# EAGLE design Easy_LED (EAGLE 6.4)
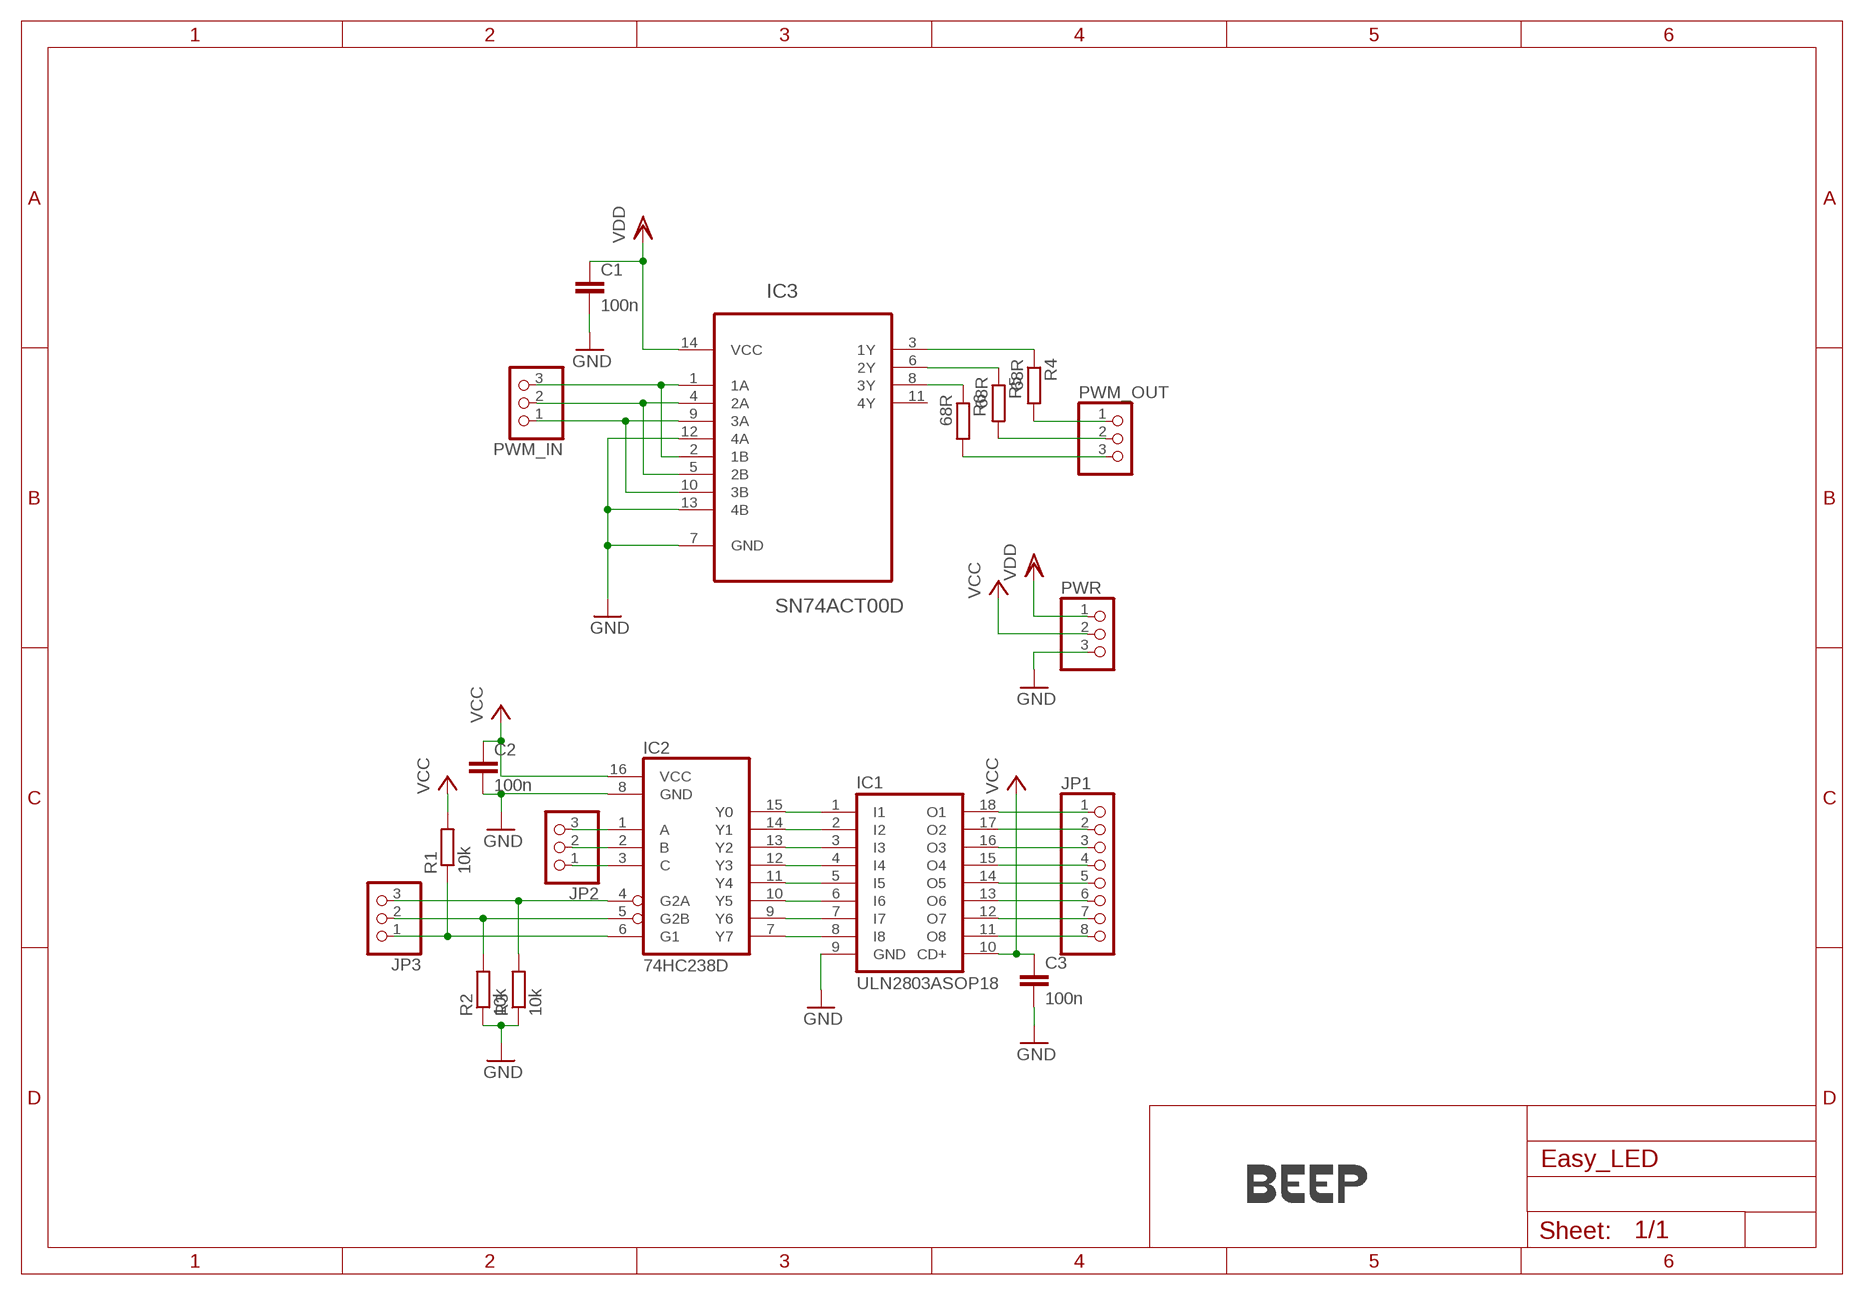
[diagram p0: schematic, sheet 1]

## Parts
C1  100n  C-EUC0805  [C0805]
C2  100n  C-EUC0805  [C0805]
C3  100n  C-EUC0805  [C0805]
IC1  ULN2803ASOP18  [SOP18]
IC2  74HC238D  [SO16]
IC3  SN74ACT00D  [SOIC127P600X175-14N]
JP1  PINHD-1X8  [1X08]
JP2  PINHD-1X3  [1X03]
JP3  PINHD-1X3  [1X03]
PWM_IN  PINHD-1X3  [1X03]
PWM_OUT  PINHD-1X3  [1X03]
PWR  PINHD-1X3  [1X03]
R1  10k  R-EU_0207/7  [0207/7]
R2  10k  R-EU_M0805  [M0805]
R3  10k  R-EU_M0805  [M0805]
R4  68R  R-EU_M0805  [M0805]
R5  68R  R-EU_M0805  [M0805]
R6  68R  R-EU_M0805  [M0805]
U$4  LOGO-COPPER6  [COPPER6]

## Nets
GND: C1.2 C2.2 C3.2 IC1.9(GND) IC2.8(GND) IC3.7(GND) IC3.12(4A) IC3.13(4B) PWR.3 R2.1 R3.1
N$1: IC1.17(O2) JP1.2
N$2: IC1.16(O3) JP1.3
N$3: IC1.15(O4) JP1.4
N$4: IC1.14(O5) JP1.5
N$5: IC1.13(O6) JP1.6
N$6: IC1.12(O7) JP1.7
N$7: IC1.18(O1) JP1.1
N$8: IC1.1(I1) IC2.15(Y0)
N$9: IC1.2(I2) IC2.14(Y1)
N$10: IC1.3(I3) IC2.13(Y2)
N$11: IC1.11(O8) JP1.8
N$12: IC3.1(1A) IC3.2(1B) PWM_IN.3
N$13: IC3.4(2A) IC3.5(2B) PWM_IN.2
N$14: IC3.9(3A) IC3.10(3B) PWM_IN.1
N$15: IC1.4(I4) IC2.12(Y3)
N$16: IC1.5(I5) IC2.11(Y4)
N$17: IC1.6(I6) IC2.10(Y5)
N$18: PWM_OUT.3 R6.2
N$19: PWM_OUT.2 R5.2
N$20: PWM_OUT.1 R4.2
N$21: IC3.3(1Y) R4.1
N$22: IC1.7(I7) IC2.9(Y6)
N$23: IC1.8(I8) IC2.7(Y7)
N$24: IC2.1(A) JP2.3
N$25: IC3.6(2Y) R5.1
N$26: IC3.8(3Y) R6.1
N$29: IC2.2(B) JP2.2
N$30: IC2.3(C) JP2.1
N$31: IC2.4(G2A) JP3.3 R3.2
N$36: IC2.5(G2B) JP3.2 R2.2
N$37: IC2.6(G1) JP3.1 R1.1
VCC: C2.1 C3.1 IC1.10(CD+) IC2.16(VCC) PWR.2 R1.2
VDD: C1.1 IC3.14(VCC) PWR.1
Unconnected: IC3.11(4Y)

## Library data of the parts
C1-C3 = rcl:C-EU: CAPACITOR, European symbol
IC1 = BEEP:ULN2803A: DRIVER ARRAY
IC2 = BEEP:74HC238: 3 to 8 line DECODER/DEMULTIPLEXER
IC3 = Texas Instruments_By_element14_Batch_1:SN74ACT00D: QUADRUPLE 2 INPUT POSITIVE NAND GATES; MPN: SN74ACT00D; OC_FARNELL: 9590315; OC_NEWARK: 52F2384; PACKAGE: SOIC-14; SUPPLIER: Texas Instruments
JP1 = pinhead:PINHD-1X8: PIN HEADER
JP2 JP3 PWM_IN PWM_OUT PWR = pinhead:PINHD-1X3: PIN HEADER
R1-R6 = rcl:R-EU_: RESISTOR, European symbol
U$4 = Branding:LOGO-COPPER

## Board
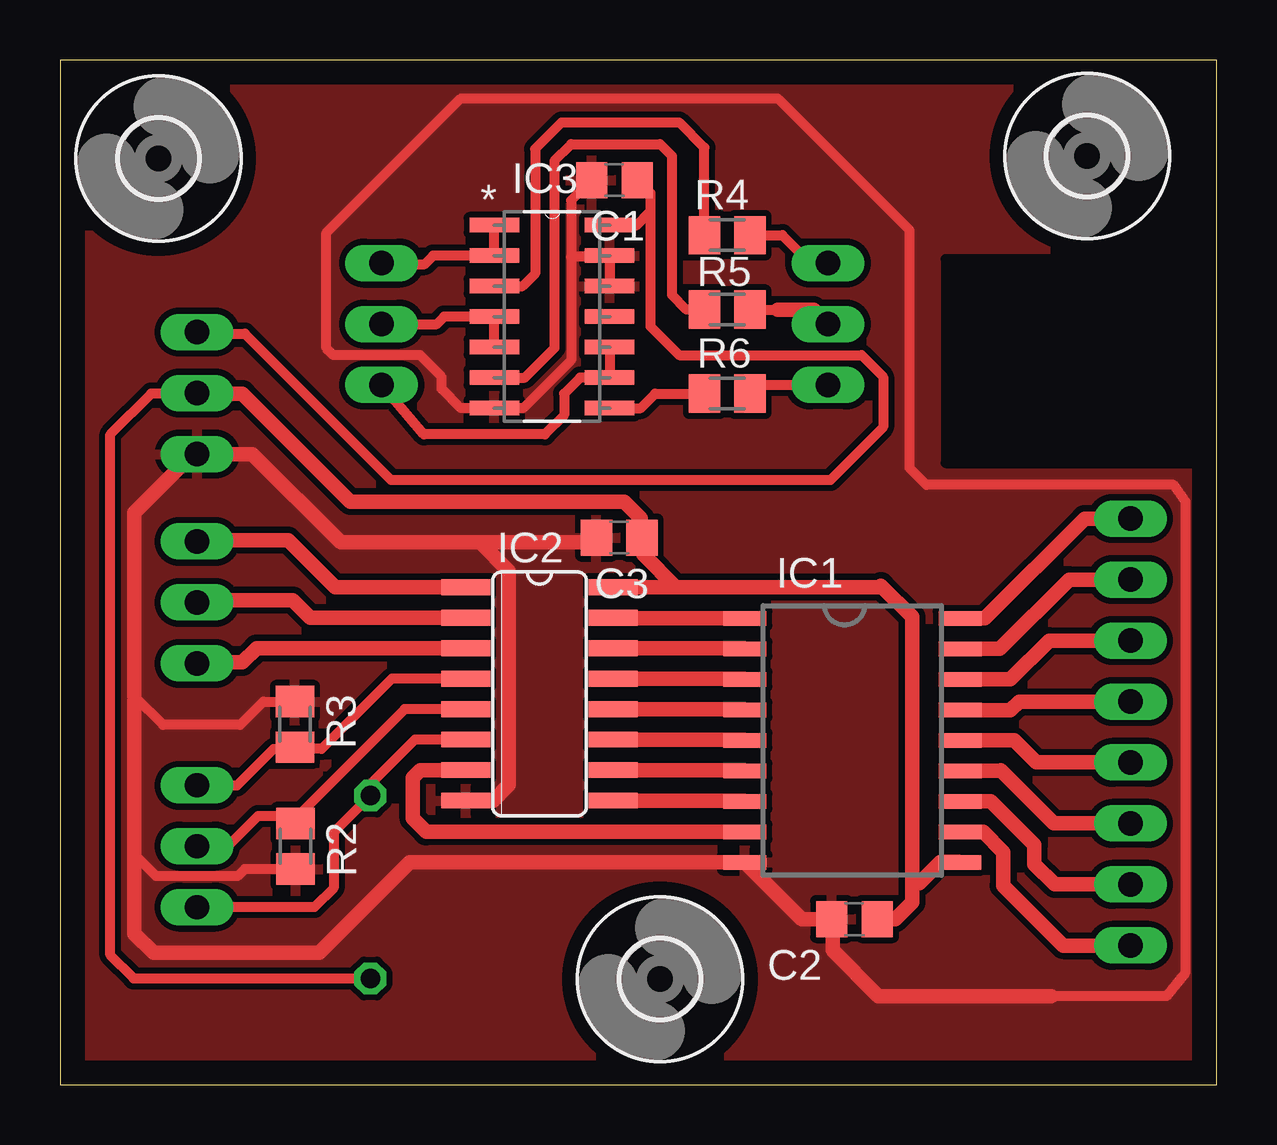
[diagram p1: board, top side]
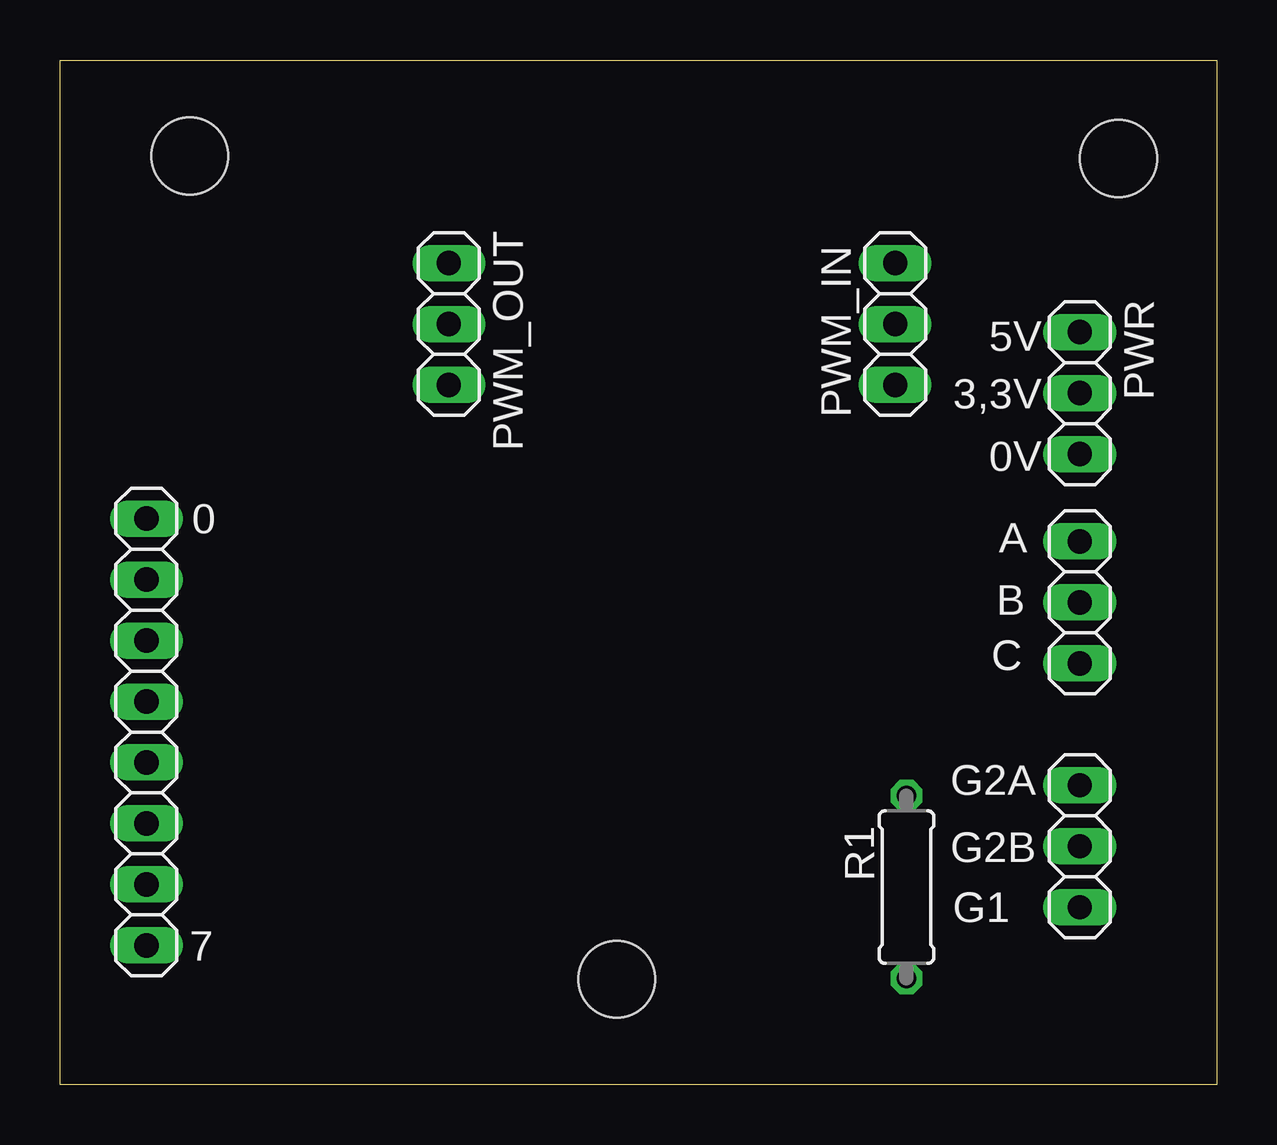
[diagram p2: board, bottom side, seen from below]

Size 48.2 x 42.7 mm. Coordinates in mm from the lower left corner, seen from the top.
Outline: 0,0 48.2,0 48.2,42.7 0,42.7 0,0
Copper layers (1*16): Top 0.035mm / dielectric 1.5mm / Bottom 0.035mm
Design rules "default *": minimum track width 10mil, minimum drill 24mil, track to track 10mil, track to pad 10mil, pad to pad 8mil, via to via 8mil, smd to smd 8mil, copper to edge 40mil, drill to drill 8mil, minimum pad ring 10mil, minimum via ring 8mil, stop-mask expansion 4mil, vias tented up to drill 0mil, thermal gap 10mil
tRestrict: area 36.9,25.9 to 48.1,34.4

### Footprints (pad centres in the part's own frame; a part is rotated, then mirrored left to right if it is on the bottom)
C0805 = smd 1.3 x 1.5: 1 -0.95,0; 2 0.95,0
SOP18 = smd 0.6 x 1.8: 1 -5.08,-4.475; 2 -3.81,-4.475; 3 -2.54,-4.475; 4 -1.27,-4.475; 5 0,-4.475; 6 1.27,-4.475; 7 2.54,-4.475; 8 3.81,-4.475; 9 5.08,-4.475; 10 5.08,4.475; 11 3.81,4.5; 12 2.54,4.5; 13 1.27,4.5; 14 0,4.5; 15 -1.27,4.5; 16 -2.54,4.5; 17 -3.81,4.5; 18 -5.08,4.5
SO16 = smd 0.66 x 2.032: 1 -4.445,-3.073; 2 -3.175,-3.073; 3 -1.905,-3.073; 4 -0.635,-3.073; 5 0.635,-3.073; 6 1.905,-3.073; 7 3.175,-3.073; 8 4.445,-3.073; 9 4.445,3.073; 10 3.175,3.073; 11 1.905,3.073; 12 0.635,3.073; 13 -0.635,3.073; 14 -1.905,3.073; 15 -3.175,3.073; 16 -4.445,3.073
SOIC127P600X175-14N = smd 2.057 x 0.61: 1 -4.801,7.62; 2 -4.801,6.35; 3 -4.801,5.08; 4 -4.801,3.81; 5 -4.801,2.54; 6 -4.801,1.27; 7 -4.801,0; 8 0,0; 9 0,1.27; 10 0,2.54; 11 0,3.81; 12 0,5.08; 13 0,6.35; 14 0,7.62
1X08 = drill 1.016 long: 1 -8.89,0; 2 -6.35,0; 3 -3.81,0; 4 -1.27,0; 5 1.27,0; 6 3.81,0; 7 6.35,0; 8 8.89,0
1X03 = drill 1.016 long: 1 -2.54,0; 2 0,0; 3 2.54,0
0207/7 = drill 0.813 octagon: 1 -3.81,0; 2 3.81,0
M0805 = smd 1.3 x 1.6: 1 -0.95,0; 2 0.95,0
3,2 = hole 3.2: 0,0

### Placement (x,y rotation side)
C1  23.1,37.7 180 top
C2  33.1,6.9 180 top
C3  23.3,22.8 180 top
IC1  33.01,14.35 270 top
IC2  19.98,16.29 270 top
IC3  22.9,28.2 0 top
JP1  44.6,14.7 270 bottom
JP2  5.71,20.1 90 bottom
JP3  5.71,9.94 90 bottom
PWM_IN  13.4,31.7 90 bottom
PWM_OUT  32,31.7 270 bottom
PWR  5.71,28.82 270 bottom
R1  12.93,8.24 270 bottom
R2  9.82,9.94 90 top
R3  9.79,15.02 270 top
R4  27.8,35.4 0 top
R5  27.8,32.3 0 top
R6  27.8,28.8 0 top
U$1  [3,2]  25,4.4 0 top
U$2  [3,2]  42.8,38.7 0 top
U$3  [3,2]  4.1,38.6 0 top
U$4  36.9,31 0 top

### Tracks (layer width: path | path; a pad name or v marks a point on that pad's centre or on a via)
GND
  Top 0.406: R2.1 7.69,8.99 7.4,8.7 4,8.7 3.1,9.6 3.1,16 3.1,16.2 4.3,15 7.5,15 8.47,15.97 R3.1 | 41.3,3.7 46.1,3.7 46.9,4.7 46.9,24.3 46.4,25 36.1,25 35.4,25.7 35.4,35.6 29.9,41.1 16.7,41.1 11.1,35.5 11.1,30.7 11.4,30.4 15,30.4 15.9,29.5 15.9,29 16.7,28.2 IC3.7 19.3,28.2 21.3,30.2 21.3,34.5 | 27.93,9.27 27.9,9.27 | C1.2 21.3,36.85 21.3,34.5 | IC3.12 IC3.13 22.85,34.5 21.3,34.5
  Top 0.61: IC2.8 18.05,11.85 18.7,12.5 18.7,21.4 17.5,22.6 | 17.5,22.6 11.7,22.6 8.02,26.28 PWR.3 5.54,26.28 3.1,23.84 3.1,16.2 | IC1.9 | 3.1,16 3.1,6.3 3.9,5.5 10.8,5.5 14.57,9.27 27.9,9.27 IC1.9 | C3.2 22.15,22.6 17.5,22.6 | IC1.9 30.9,6.9 C2.2 32.2,6.85 32.2,5.6 34.1,3.7 41.3,3.7
  pour Top: 0,0 48.2,0 48.2,42.7 0,42.7
N$1
  Top 0.61: IC1.17 39.16,18.16 42.05,21.05 JP1.2
N$2
  Top 0.61: IC1.16 39.59,16.89 41.21,18.51 JP1.3
N$3
  Top 0.61: JP1.4 39.97,15.97 39.6,15.6 37.53,15.6 IC1.15
N$4
  Top 0.61: IC1.14 39.75,14.35 40.67,13.43 JP1.5
N$5
  Top 0.61: IC1.13 39.18,13.08 39.2,13.1 41.41,10.89 JP1.6
N$6
  Top 0.61: IC1.12 38.79,11.81 40.6,10 40.6,9.2 41.45,8.35 JP1.7
N$7
  Top 0.61: IC1.18 38.53,19.43 42.69,23.59 JP1.1
N$8
  Top 0.61: IC1.1 22.79,19.43 IC2.15
N$9
  Top 0.61: IC2.14 28.5,18.2 IC1.2
N$10
  Top 0.61: IC2.13 28.5,16.93 IC1.3
N$11
  Top 0.61: IC1.11 38.46,10.54 39.3,9.7 39.3,8.3 41.8,5.8 43.39,5.8 JP1.8
N$12
  Top 0.406: IC3.1 IC3.2 15.55,34.55 15.2,34.2 13.44,34.2 PWM_IN.3
N$13
  Top 0.406: IC3.5 IC3.4 16.01,32.01 15.7,31.7 PWM_IN.2
N$14
  Top 0.406: IC3.10 IC3.9 21.67,29.47 21,28.8 21,27.9 20.2,27.1 15.16,27.1 PWM_IN.1
N$15
  Top 0.61: IC2.12 28.5,15.65 IC1.4
N$16
  Top 0.61: IC2.11 28.5,14.38 IC1.5
N$17
  Top 0.61: IC2.10 28.5,13.12 IC1.6
N$18
  Top 0.406: R6.2 29.11,29.16 PWM_OUT.3
N$19
  Top 0.406: R5.2 29.9,32.3
  Top 0.61: PWM_OUT.2 31.4,32.3 29.9,32.3
N$20
  Top 0.406: R4.2 30.1,35.4 31.56,33.94 PWM_OUT.1
N$21
  Top 0.406: R4.1 26.85,39.05 25.8,40.1 20.9,40.1 19.8,39 19.8,33.8 19.28,33.28 IC3.3
N$22
  Top 0.61: IC2.9 28.5,11.85 IC1.7
N$23
  Top 0.61: IC1.8 15.26,10.54 14.7,11.1 14.7,12.8 15,13.1 16.59,13.1 IC2.7
N$24
  Top 0.61: IC2.1 11.46,20.73 9.5,22.7 5.77,22.7 JP2.3
N$25
  Top 0.406: IC3.6 19.37,29.47 20.6,30.7 20.6,38.5 21.3,39.2 25,39.2 25.5,38.7 25.5,32.9 26.1,32.3 R5.1
N$26
  Top 0.406: IC3.8 24.2,28.2 24.8,28.8 R6.1
N$29
  Top 0.61: IC2.2 10.44,19.46 9.7,20.2 5.81,20.2 JP2.2
N$30
  Top 0.61: IC2.3 8.2,18.2 7.6,17.6 5.75,17.6 JP2.1
N$31
  Top 0.406: IC2.4 13.82,16.93 10.9,14 9.86,14 | JP3.3 7.38,12.48 8.9,14 9.72,14
  Top 0.61: 9.72,14 R3.2 9.86,14
N$36
  Top 0.406: JP3.2 6.98,9.94 8.25,11.21 9.2,11.21 R2.2 | IC2.5 14.36,15.65 9.9,11.2
  Top 0.61: 9.9,11.2 9.83,11.2 R2.2
N$37
  Top 0.406: IC2.6 14.79,14.38 12.93,12.53 R1.1 11.4,10.52 11.4,8.2 10.6,7.4 JP3.1
VCC
  Top 0.406: R1.2 3.07,4.43 2.1,5.4 2.1,27.1 3.8,28.8 5.73,28.8
  Top 0.61: 35.5,8.4 35.5,7.6 34.8,6.9 C2.1 | 35.5,8.4 35.5,19.5 34.2,20.8 34.13,20.73 25.66,20.73 | PWR.2 5.73,28.8 7.6,28.8 12.1,24.3 23.5,24.3 24.2,23.6 24.2,22.85 C3.1 24.3,22.75 24.3,22.1 25.66,20.73 | 25.66,20.73 IC2.16 | IC1.10 37.45,9.3 36.7,9.3 35.8,8.4 35.5,8.4
VDD
  Top 0.406: 24.6,36.4 24.6,37.15 C1.1 | 24.6,36.4 24.6,31.6 25.8,30.4 33.4,30.4 34.3,29.5 34.3,27.4 32.1,25.2 13.8,25.2 7.7,31.3 5.77,31.3 PWR.1 | IC3.14 22.92,35.8 24,35.8 24.6,36.4

### Text on the board
bPlace: 0 | A | B | C | G2A | G2B | G1 | 7
bNames: 5V | 3,3V | 0V
tCName: Easy LED / v0.2